# EAGLE design output_max10 (EAGLE 9.0.1)

## Sheet 1 of 2: IO and Memory
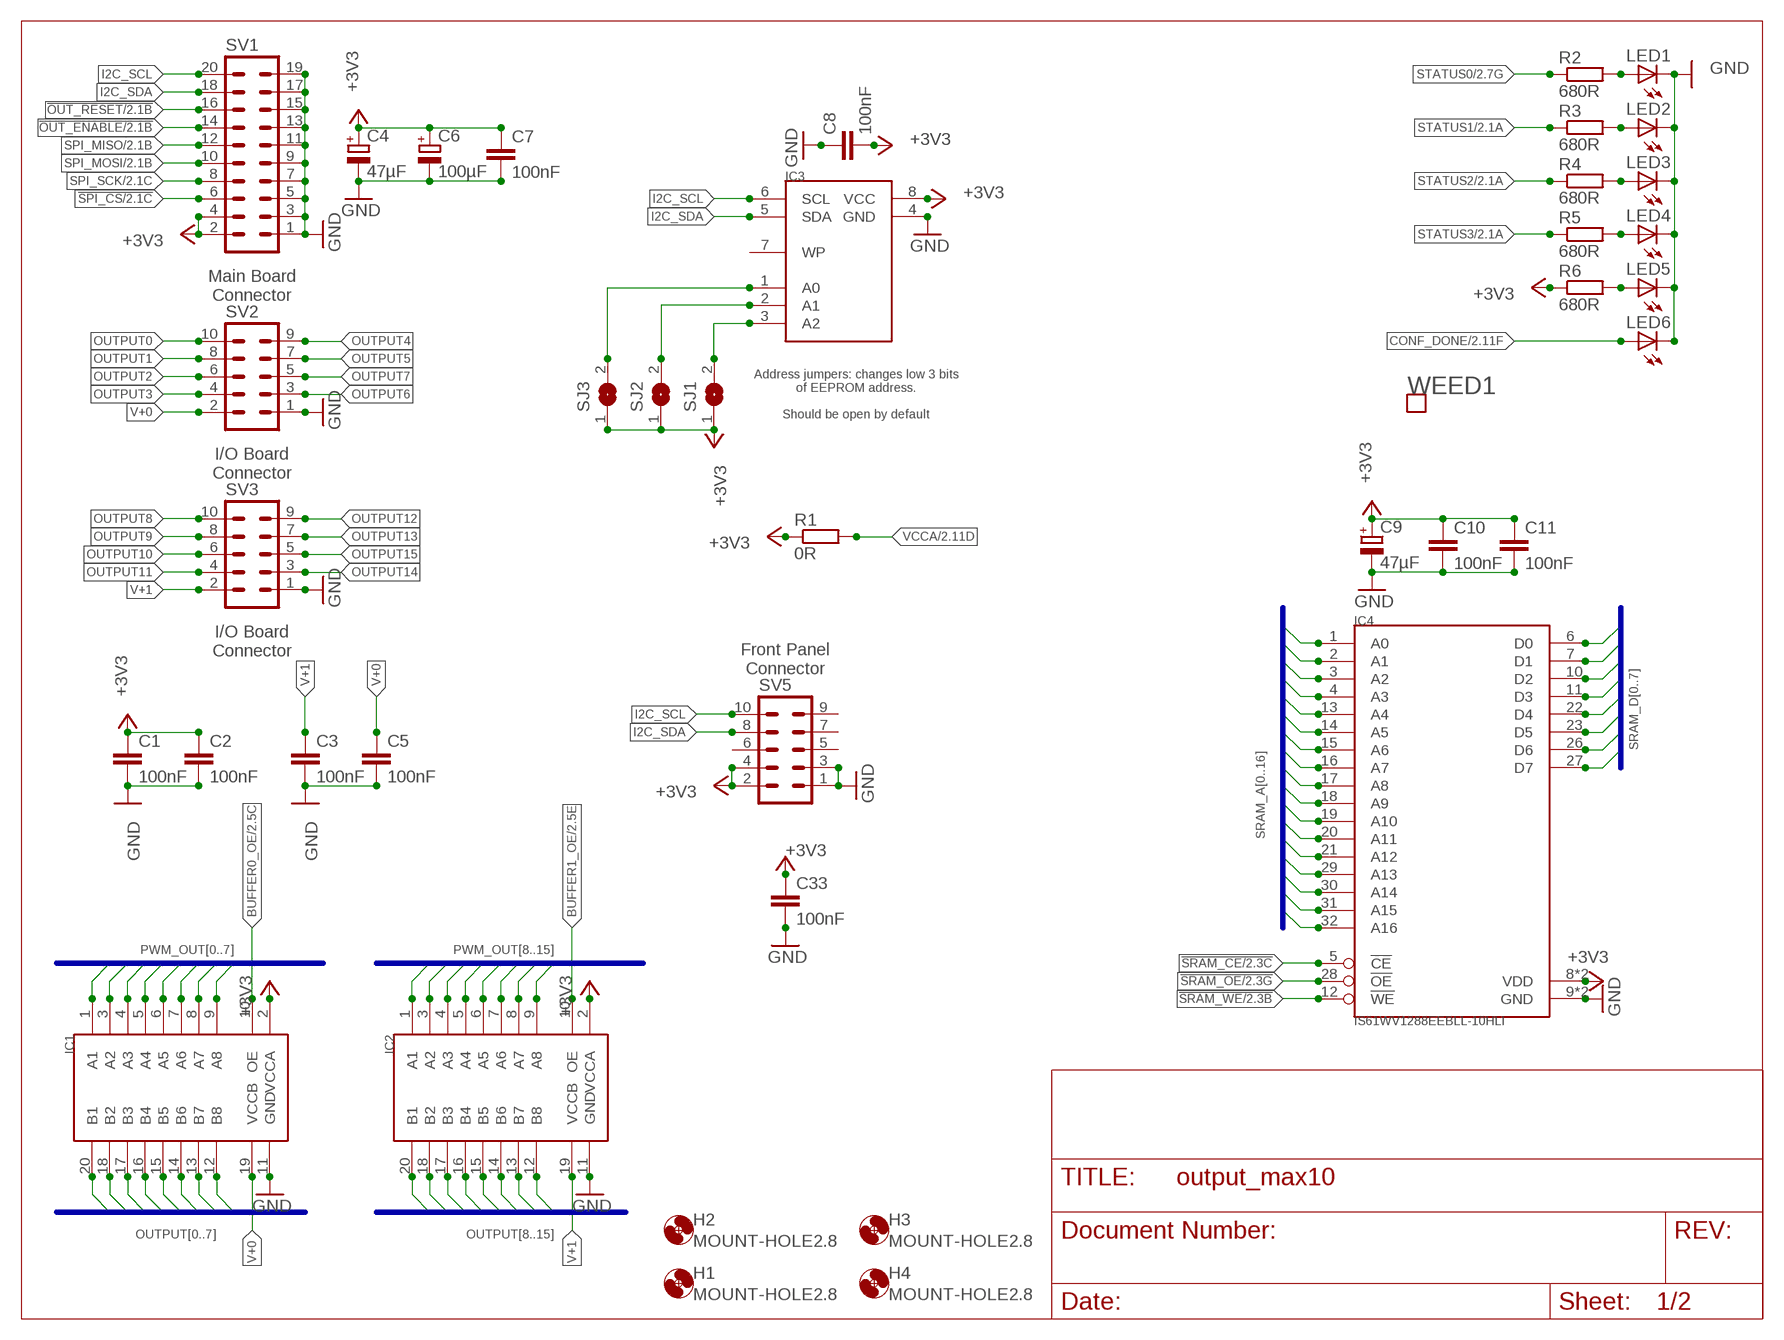
[diagram p0: schematic, sheet 1]

### Parts
C1  100nF  C-EUC0805  [C0805]
C2  100nF  C-EUC0805  [C0805]
C3  100nF  C-EUC0805  [C0805]
C4  47µF  CPOL-EUCT7343  [CT7343]
C5  100nF  C-EUC0805  [C0805]
C6  100µF  CPOL-EUCT7343  [CT7343]
C7  100nF  C-EUC0805  [C0805]
C8  100nF  C-EUC0805  [C0805]
C9  47µF  CPOL-EUCT7343  [CT7343]
C10  100nF  C-EUC0805  [C0805]
C11  100nF  C-EUC0805  [C0805]
C33  100nF  C-EUC0805  [C0805]
H1  MOUNT-HOLE2.8  [2,8]
H2  MOUNT-HOLE2.8  [2,8]
H3  MOUNT-HOLE2.8  [2,8]
H4  MOUNT-HOLE2.8  [2,8]
IC1  TXB0108TSSOP20  [TSSOP20]
IC2  TXB0108TSSOP20  [TSSOP20]
IC3  AT24C02DSOIC-8  [SOIC8]
IC4  IS61WV1288EEBLL-10HLI  IS61WV1288EEBLLTSOP32-I  [TSOP8X16]
LED1  LEDCHIPLED_1206  [CHIPLED_1206]
LED2  LEDCHIPLED_1206  [CHIPLED_1206]
LED3  LEDCHIPLED_1206  [CHIPLED_1206]
LED4  LEDCHIPLED_1206  [CHIPLED_1206]
LED5  LEDCHIPLED_1206  [CHIPLED_1206]
LED6  LEDCHIPLED_1206  [CHIPLED_1206]
R1  0R  R-EU_R2012  [R2012]
R2  680R  R-EU_M0805  [M0805]
R3  680R  R-EU_M0805  [M0805]
R4  680R  R-EU_M0805  [M0805]
R5  680R  R-EU_M0805  [M0805]
R6  680R  R-EU_M0805  [M0805]
SJ1  SJ  [SJ]
SJ2  SJ  [SJ]
SJ3  SJ  [SJ]
SV1  MA10-2  [MA10-2]
SV2  MA05-2  [MA05-2]
SV3  MA05-2  [MA05-2]
SV5  MA05-2  [MA05-2]
WEED1  WEED  [DOINK]

### Nets
!OUT_ENABLE: SV1.14 ; also sheet 2
!OUT_RESET: SV1.16 ; also sheet 2
!SPI_CS: SV1.6 ; also sheet 2
!SRAM_CE: IC4.5(!CE) ; also sheet 2
!SRAM_OE: IC4.28(!OE) ; also sheet 2
!SRAM_WE: IC4.12(!WE) ; also sheet 2
+3V3: C1.1 C2.1 C4.+ C6.+ C7.1 C8.2 C9.+ C10.1 C11.1 C33.1 IC1.2(VCCA) IC2.2(VCCA) IC3.8(VCC) IC4.8(VDD) IC4.24(VDD) R1.1 R6.1 SJ1.1 SJ2.1 SJ3.1 SV1.2 SV1.4 SV5.2 SV5.4 ; also sheet 2
BUFFER0_OE: IC1.10(OE) ; also sheet 2
BUFFER1_OE: IC2.10(OE) ; also sheet 2
CONF_DONE: LED6.A ; also sheet 2
GND: C1.2 C2.2 C3.2 C4.- C5.2 C6.- C7.2 C8.1 C9.- C10.2 C11.2 C33.2 IC1.11(GND) IC2.11(GND) IC3.4(GND) IC4.9(GND) IC4.25(GND) LED1.C LED2.C LED3.C LED4.C LED5.C LED6.C SV1.1 SV1.3 SV1.5 SV1.7 SV1.9 SV1.11 SV1.13 SV1.15 SV1.17 SV1.19 SV2.1 SV3.1 SV5.1 SV5.3 ; also sheet 2
I2C_SCL: IC3.6(SCL) SV1.20 SV5.10
I2C_SDA: IC3.5(SDA) SV1.18 SV5.8
N$1: LED3.A R4.2
N$2: LED4.A R5.2
N$3: LED5.A R6.2
N$5: IC3.3(A2) SJ1.2
N$6: IC3.2(A1) SJ2.2
N$7: IC3.1(A0) SJ3.2
N$13: LED1.A R2.2
N$14: LED2.A R3.2
OUTPUT0: IC1.20(B1) SV2.10
OUTPUT1: IC1.18(B2) SV2.8
OUTPUT2: IC1.17(B3) SV2.6
OUTPUT3: IC1.16(B4) SV2.4
OUTPUT4: IC1.15(B5) SV2.9
OUTPUT5: IC1.14(B6) SV2.7
OUTPUT6: IC1.13(B7) SV2.3
OUTPUT7: IC1.12(B8) SV2.5
OUTPUT8: IC2.20(B1) SV3.10
OUTPUT9: IC2.18(B2) SV3.8
OUTPUT10: IC2.17(B3) SV3.6
OUTPUT11: IC2.16(B4) SV3.4
OUTPUT12: IC2.15(B5) SV3.9
OUTPUT13: IC2.14(B6) SV3.7
OUTPUT14: IC2.13(B7) SV3.3
OUTPUT15: IC2.12(B8) SV3.5
PWM_OUT0: IC1.9(A8) ; also sheet 2
PWM_OUT1: IC1.8(A7) ; also sheet 2
PWM_OUT2: IC1.7(A6) ; also sheet 2
PWM_OUT3: IC1.6(A5) ; also sheet 2
PWM_OUT4: IC1.5(A4) ; also sheet 2
PWM_OUT5: IC1.4(A3) ; also sheet 2
PWM_OUT6: IC1.3(A2) ; also sheet 2
PWM_OUT7: IC1.1(A1) ; also sheet 2
PWM_OUT8: IC2.9(A8) ; also sheet 2
PWM_OUT9: IC2.8(A7) ; also sheet 2
PWM_OUT10: IC2.7(A6) ; also sheet 2
PWM_OUT11: IC2.6(A5) ; also sheet 2
PWM_OUT12: IC2.5(A4) ; also sheet 2
PWM_OUT13: IC2.4(A3) ; also sheet 2
PWM_OUT14: IC2.3(A2) ; also sheet 2
PWM_OUT15: IC2.1(A1) ; also sheet 2
SPI_MISO: SV1.12 ; also sheet 2
SPI_MOSI: SV1.10 ; also sheet 2
SPI_SCK: SV1.8 ; also sheet 2
SRAM_A0: IC4.1(A0) ; also sheet 2
SRAM_A1: IC4.2(A1) ; also sheet 2
SRAM_A2: IC4.3(A2) ; also sheet 2
SRAM_A3: IC4.4(A3) ; also sheet 2
SRAM_A4: IC4.13(A4) ; also sheet 2
SRAM_A5: IC4.14(A5) ; also sheet 2
SRAM_A6: IC4.15(A6) ; also sheet 2
SRAM_A7: IC4.16(A7) ; also sheet 2
SRAM_A8: IC4.17(A8) ; also sheet 2
SRAM_A9: IC4.18(A9) ; also sheet 2
SRAM_A10: IC4.19(A10) ; also sheet 2
SRAM_A11: IC4.20(A11) ; also sheet 2
SRAM_A12: IC4.21(A12) ; also sheet 2
SRAM_A13: IC4.29(A13) ; also sheet 2
SRAM_A14: IC4.30(A14) ; also sheet 2
SRAM_A15: IC4.31(A15) ; also sheet 2
SRAM_A16: IC4.32(A16) ; also sheet 2
SRAM_D0: IC4.6(D0) ; also sheet 2
SRAM_D1: IC4.7(D1) ; also sheet 2
SRAM_D2: IC4.10(D2) ; also sheet 2
SRAM_D3: IC4.11(D3) ; also sheet 2
SRAM_D4: IC4.22(D4) ; also sheet 2
SRAM_D5: IC4.23(D5) ; also sheet 2
SRAM_D6: IC4.26(D6) ; also sheet 2
SRAM_D7: IC4.27(D7) ; also sheet 2
STATUS0: R2.1 ; also sheet 2
STATUS1: R3.1 ; also sheet 2
STATUS2: R4.1 ; also sheet 2
STATUS3: R5.1 ; also sheet 2
V+0: C5.1 IC1.19(VCCB) SV2.2
V+1: C3.1 IC2.19(VCCB) SV3.2
VCCA: R1.2 ; also sheet 2
Unconnected: IC3.7(WP) SV5.5 SV5.6 SV5.7 SV5.9

### Buses
SRAM_D[0..7]
SRAM_A[0..16]
PWM_OUT[0..7]
OUTPUT[0..7]
OUTPUT[8..15]
PWM_OUT[8..15]

### Notes on the sheet
- Main Board
  Connector
- Address jumpers: changes low 3 bits
  of EEPROM address.
  
  Should be open by default
- I/O Board
  Connector
- I/O Board
  Connector
- Front Panel
  Connector

## Sheet 2 of 2: FPGA
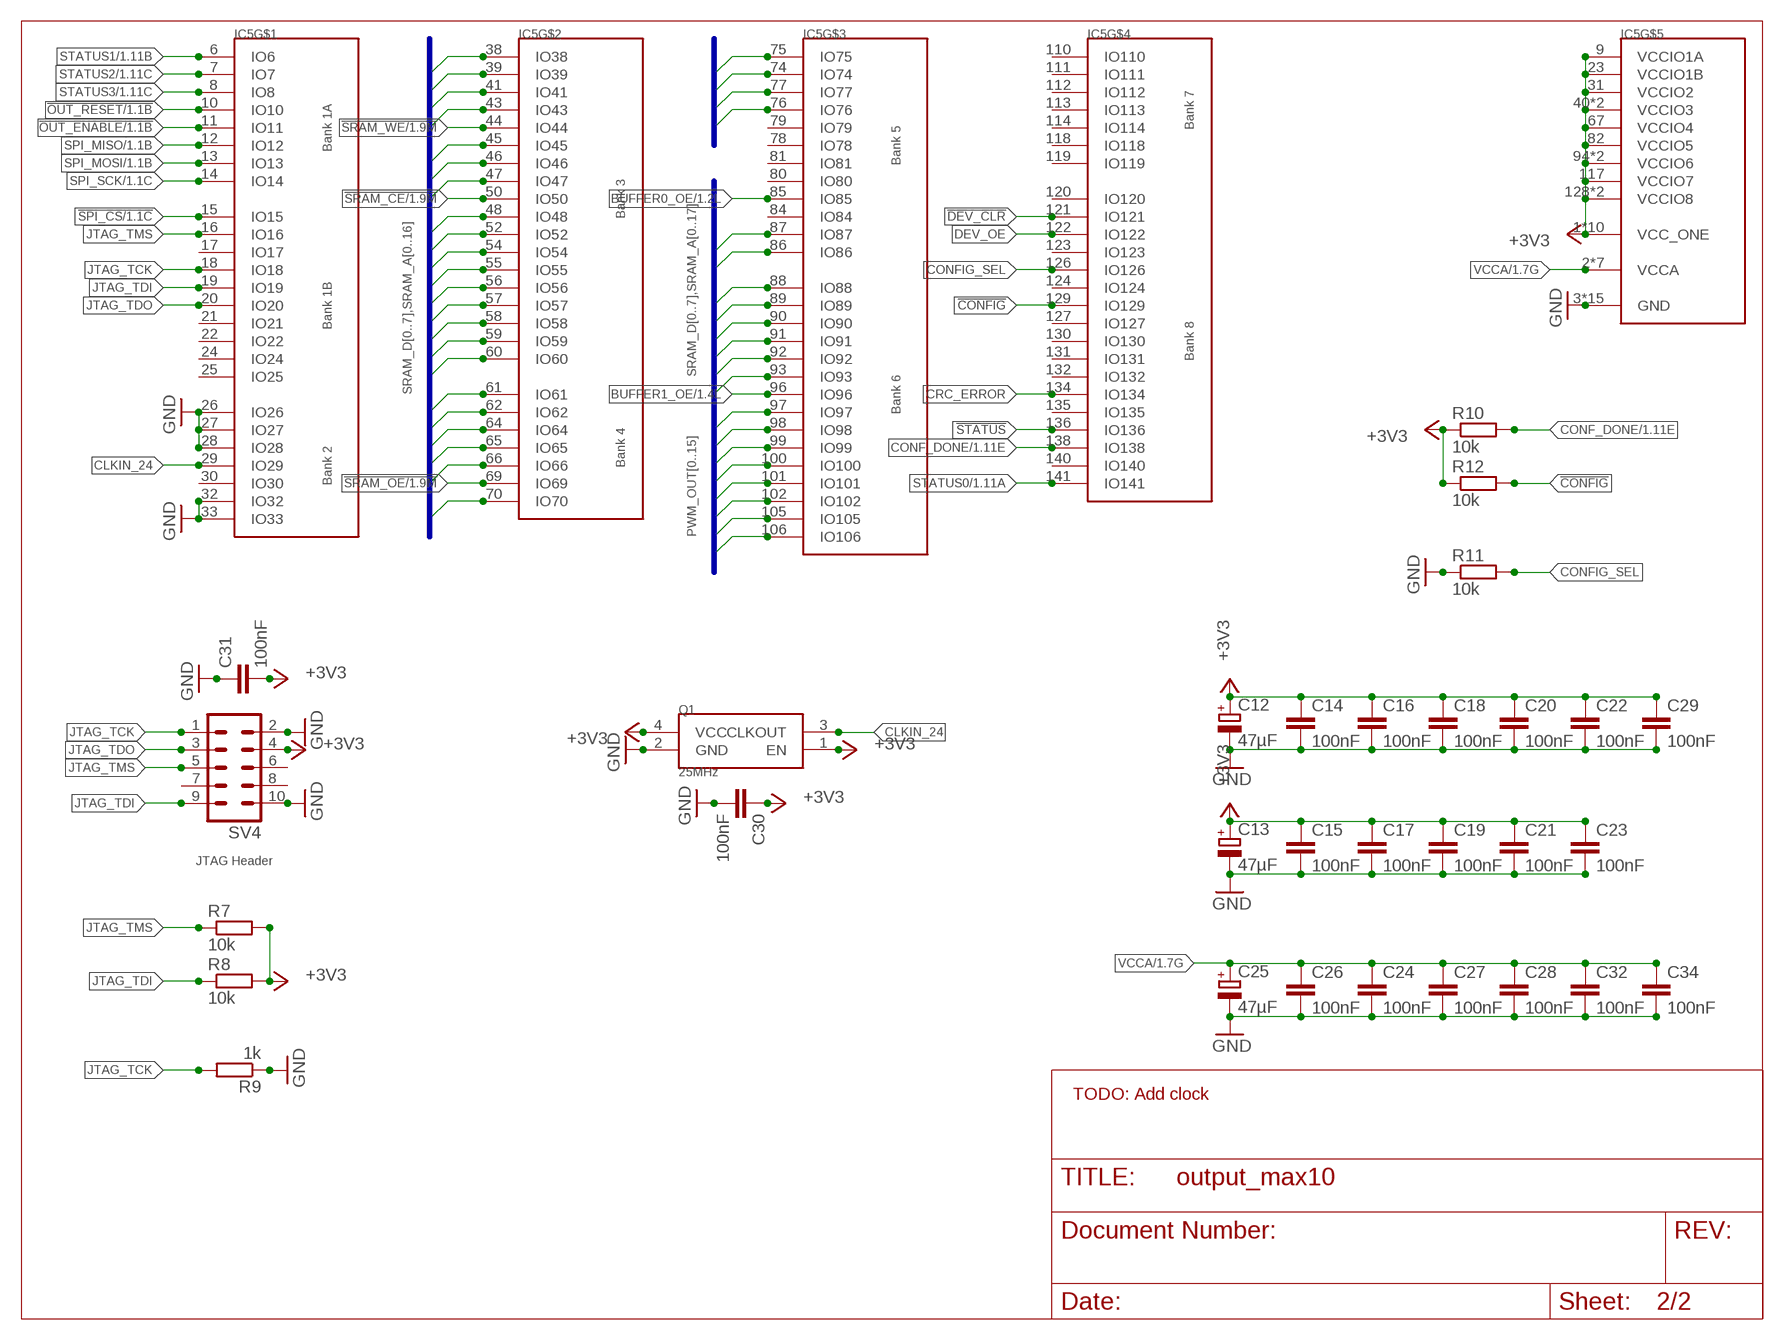
[diagram p1: schematic, sheet 2]

### Parts
C12  47µF  CPOL-EUCT7343  [CT7343]
C13  47µF  CPOL-EUCT7343  [CT7343]
C14  100nF  C-EUC0805  [C0805]
C15  100nF  C-EUC0805  [C0805]
C16  100nF  C-EUC0805  [C0805]
C17  100nF  C-EUC0805  [C0805]
C18  100nF  C-EUC0805  [C0805]
C19  100nF  C-EUC0805  [C0805]
C20  100nF  C-EUC0805  [C0805]
C21  100nF  C-EUC0805  [C0805]
C22  100nF  C-EUC0805  [C0805]
C23  100nF  C-EUC0805  [C0805]
C24  100nF  C-EUC0805  [C0805]
C25  47µF  CPOL-EUCT7343  [CT7343]
C26  100nF  C-EUC0805  [C0805]
C27  100nF  C-EUC0805  [C0805]
C28  100nF  C-EUC0805  [C0805]
C29  100nF  C-EUC0805  [C0805]
C30  100nF  C-EUC0805  [C0805]
C31  100nF  C-EUC0805  [C0805]
C32  100nF  C-EUC0805  [C0805]
C34  100nF  C-EUC0805  [C0805]
IC5  10M04EQFP144  [EQFP144]
Q1  25MHz  DSC61XX  [VLGA-4]
R7  10k  R-EU_M0805  [M0805]
R8  10k  R-EU_M0805  [M0805]
R9  1k  R-EU_M0805  [M0805]
R10  10k  R-EU_M0805  [M0805]
R11  10k  R-EU_M0805  [M0805]
R12  10k  R-EU_M0805  [M0805]
SV4  MA05-2  [MA05-2]

### Nets
!CONFIG: IC5.129(IO129) R12.2
!DEV_CLR: IC5.121(IO121)
!OUT_ENABLE: IC5.11(IO11) ; also sheet 1
!OUT_RESET: IC5.10(IO10) ; also sheet 1
!SPI_CS: IC5.15(IO15) ; also sheet 1
!SRAM_CE: IC5.50(IO50) ; also sheet 1
!SRAM_OE: IC5.69(IO69) ; also sheet 1
!SRAM_WE: IC5.44(IO44) ; also sheet 1
!STATUS: IC5.136(IO136)
+3V3: C12.+ C13.+ C14.1 C15.1 C16.1 C17.1 C18.1 C19.1 C20.1 C21.1 C22.1 C23.1 C29.1 C30.1 C31.2 IC5.1(VCC_ONE) IC5.9(VCCIO1A) IC5.23(VCCIO1B) IC5.31(VCCIO2) IC5.36(VCC_ONE) IC5.37(VCC_ONE) IC5.40(VCCIO3) IC5.49(VCCIO3) IC5.51(VCC_ONE) IC5.67(VCCIO4) IC5.72(VCC_ONE) IC5.73(VCC_ONE) IC5.82(VCCIO5) IC5.94(VCCIO6) IC5.103(VCCIO6) IC5.108(VCC_ONE) IC5.109(VCC_ONE) IC5.115(VCC_ONE) IC5.117(VCCIO7) IC5.128(VCCIO8) IC5.139(VCCIO8) IC5.144(VCC_ONE) Q1.1(EN) Q1.4(VCC) R7.2 R8.2 R10.1 R12.1 SV4.4 ; also sheet 1
BUFFER0_OE: IC5.85(IO85) ; also sheet 1
BUFFER1_OE: IC5.96(IO96) ; also sheet 1
CLKIN_24: IC5.29(IO29) Q1.3(CLKOUT)
CONF_DONE: IC5.138(IO138) R10.2 ; also sheet 1
CONFIG_SEL: IC5.126(IO126) R11.2
CRC_ERROR: IC5.134(IO134)
DEV_OE: IC5.122(IO122)
GND: C12.- C13.- C14.2 C15.2 C16.2 C17.2 C18.2 C19.2 C20.2 C21.2 C22.2 C23.2 C24.2 C25.- C26.2 C27.2 C28.2 C29.2 C30.2 C31.1 C32.2 C34.2 IC5.3(GND) IC5.4(GND) IC5.26(IO26) IC5.27(IO27) IC5.28(IO28) IC5.32(IO32) IC5.33(IO33) IC5.42(GND) IC5.53(GND) IC5.63(GND) IC5.68(GND) IC5.83(GND) IC5.95(GND) IC5.104(GND) IC5.116(GND) IC5.125(GND) IC5.133(GND) IC5.137(GND) IC5.142(GND) IC5.PAD(GND) Q1.2(GND) R9.1 R11.1 SV4.2 SV4.10 ; also sheet 1
JTAG_TCK: IC5.18(IO18) R9.2 SV4.1
JTAG_TDI: IC5.19(IO19) R8.1 SV4.9
JTAG_TDO: IC5.20(IO20) SV4.3
JTAG_TMS: IC5.16(IO16) R7.1 SV4.5
PWM_OUT0: IC5.86(IO86) ; also sheet 1
PWM_OUT1: IC5.87(IO87) ; also sheet 1
PWM_OUT2: IC5.88(IO88) ; also sheet 1
PWM_OUT3: IC5.89(IO89) ; also sheet 1
PWM_OUT4: IC5.90(IO90) ; also sheet 1
PWM_OUT5: IC5.91(IO91) ; also sheet 1
PWM_OUT6: IC5.92(IO92) ; also sheet 1
PWM_OUT7: IC5.93(IO93) ; also sheet 1
PWM_OUT8: IC5.97(IO97) ; also sheet 1
PWM_OUT9: IC5.98(IO98) ; also sheet 1
PWM_OUT10: IC5.99(IO99) ; also sheet 1
PWM_OUT11: IC5.100(IO100) ; also sheet 1
PWM_OUT12: IC5.101(IO101) ; also sheet 1
PWM_OUT13: IC5.102(IO102) ; also sheet 1
PWM_OUT14: IC5.105(IO105) ; also sheet 1
PWM_OUT15: IC5.106(IO106) ; also sheet 1
SPI_MISO: IC5.12(IO12) ; also sheet 1
SPI_MOSI: IC5.13(IO13) ; also sheet 1
SPI_SCK: IC5.14(IO14) ; also sheet 1
SRAM_A0: IC5.56(IO56) ; also sheet 1
SRAM_A1: IC5.55(IO55) ; also sheet 1
SRAM_A2: IC5.54(IO54) ; also sheet 1
SRAM_A3: IC5.52(IO52) ; also sheet 1
SRAM_A4: IC5.43(IO43) ; also sheet 1
SRAM_A5: IC5.41(IO41) ; also sheet 1
SRAM_A6: IC5.39(IO39) ; also sheet 1
SRAM_A7: IC5.38(IO38) ; also sheet 1
SRAM_A8: IC5.57(IO57) ; also sheet 1
SRAM_A9: IC5.58(IO58) ; also sheet 1
SRAM_A10: IC5.59(IO59) ; also sheet 1
SRAM_A11: IC5.60(IO60) ; also sheet 1
SRAM_A12: IC5.61(IO61) ; also sheet 1
SRAM_A13: IC5.70(IO70) ; also sheet 1
SRAM_A14: IC5.76(IO76) ; also sheet 1
SRAM_A15: IC5.75(IO75) ; also sheet 1
SRAM_A16: IC5.74(IO74) ; also sheet 1
SRAM_A17: IC5.77(IO77)
SRAM_D0: IC5.48(IO48) ; also sheet 1
SRAM_D1: IC5.47(IO47) ; also sheet 1
SRAM_D2: IC5.46(IO46) ; also sheet 1
SRAM_D3: IC5.45(IO45) ; also sheet 1
SRAM_D4: IC5.62(IO62) ; also sheet 1
SRAM_D5: IC5.64(IO64) ; also sheet 1
SRAM_D6: IC5.65(IO65) ; also sheet 1
SRAM_D7: IC5.66(IO66) ; also sheet 1
STATUS0: IC5.141(IO141) ; also sheet 1
STATUS1: IC5.6(IO6) ; also sheet 1
STATUS2: IC5.7(IO7) ; also sheet 1
STATUS3: IC5.8(IO8) ; also sheet 1
VCCA: C24.1 C25.+ C26.1 C27.1 C28.1 C32.1 C34.1 IC5.2(VCCA) IC5.5(VCCA) IC5.34(VCCA) IC5.35(VCCA) IC5.71(VCCA) IC5.107(VCCA) IC5.143(VCCA) ; also sheet 1
Unconnected: IC5.17(IO17) IC5.21(IO21) IC5.22(IO22) IC5.24(IO24) IC5.25(IO25) IC5.30(IO30) IC5.78(IO78) IC5.79(IO79) IC5.80(IO80) IC5.81(IO81) IC5.84(IO84) IC5.110(IO110) IC5.111(IO111) IC5.112(IO112) IC5.113(IO113) IC5.114(IO114) IC5.118(IO118) IC5.119(IO119) IC5.120(IO120) IC5.123(IO123) IC5.124(IO124) IC5.127(IO127) IC5.130(IO130) IC5.131(IO131) IC5.132(IO132) IC5.135(IO135) IC5.140(IO140) SV4.6 SV4.7 SV4.8

### Buses
SRAM_D[0..7],SRAM_A[0..16]
SRAM_D[0..7],SRAM_A[0..17]
PWM_OUT[0..15]

### Notes on the sheet
- JTAG Header
- TODO: Add clock

## Library data of the parts
C1-C3 C5 C7 C8 C10 C11 C14-C24 C26-C34 = rcl:C-EU: CAPACITOR, European symbol; MOUSER: 710-885012207072; SPICEPREFIX: C
C4 C9 C12 C13 C25 = rcl:CPOL-EU: POLARIZED CAPACITOR, European symbol; MOUSER: 581-TAJD476M016RNJV; SPICEPREFIX: C
C6 = rcl:CPOL-EU: POLARIZED CAPACITOR, European symbol; MOUSER: 581-NOSD107M006; SPICEPREFIX: C
H1-H4 = holes:MOUNT-HOLE: MOUNTING HOLE with drill center marker
IC1 IC2 = lichtenstein_onion:TXB0108: 8-Bit Bidirectional Voltage-Level Translator with Auto-Direction Sensing and ±15-kV ESD Protection Datasheet <http://www.ti.com/lit/ds/symlink/txb0108.pdf>; MOUSER: 595-TXB0108PWR
IC3 = lichtenstein_onion:AT24C02D: I2C-Compatible (2-wire) Serial EEPROM; 1-Kbit (128 x 8) or 2-Kbit (256 x 8) Datasheet <http://ww1.microchip.com/downloads/en/DeviceDoc/Atmel-8871F-SEEPROM-AT24C01D-02D-Datasheet.pdf>; MOUSER: 556-AT24C02D-SSHM-T
IC4 = lichtenstein_onion:IS61WV1288EEBLL: 128K x 8 HIGH SPEED ASYNCHRONOUS CMOS STATIC RAM WITH ECC Datasheet <https://www.mouser.com/datasheet/2/198/61-64WV1288EEBLL-337356.pdf>; MOUSER: 870-61WV1288ELL10HLI
IC5 = lichtenstein_onion:10M04: 10M04SCE144 edit this description Auto generated by make-symbol-device-package-bsdl.ulp Rev. 44 Source: 10M04SCE144.bsd; MOUSER: 989-10M04SCE144C8G
LED1 = led:LED: LED OSRAM: - CHIPLED LG R971, LG N971, LY N971, LG Q971, LY Q971, LO R971, LY R971 LH N974, LH R974 LS Q976, LO Q976, LY Q976 LO Q996 - Hyper CHIPLED LW Q18S LB Q993, LB Q99A, LB R99A - SideLED LS A670, LO A670, LY A670, LG A670, LP A670 LB A673, LV A673, LT A673, LW A673 LH A674 LY A675 LS A676, LA A676, LO A676, LY A676, LW A676 LS A679, LY A679, LG A679 - Hyper Micro SIDELED® LS Y876, LA Y876, LO Y876, LY Y876 LT Y87S - SmartLED LW L88C, LW L88S LB L89C, LB L89S, LG L890 LS L89K, LO L89K, LY L89K LS L896, LA L896, LO L896, LY L896 - TOPLED LS T670, LO T670, LY T670, LG T670, LP T670 LSG T670, LSP T670, LSY T670, LOP T670, LYG T670 LG T671, LOG T671, LSG T671 LB T673, LV T673, LT T673, LW T673 LH T674 LS T676, LA T676, LO T676, LY T676, LB T676, LH T676, LSB T676, LW T676 LB T67C, LV T67C, LT T67C, LS T67K, LO T67K, LY T67K, LW E67C LS E67B, LA E67B, LO E67B, LY E67B, LB E67C, LV E67C, LT E67C LW T67C LS T679, LY T679, LG T679 LS T770, LO T770, LY T770, LG T770, LP T770 LB T773, LV T773, LT T773, LW T773 LH T774 LS E675, LA E675, LY E675, LS T675 LS T776, LA T776, LO T776, LY T776, LB T776 LHGB T686 LT T68C, LB T68C - Hyper Mini TOPLED® LB M676 - Mini TOPLED Santana® LG M470 LS M47K, LO M47K, LY M47K Source: http://www.osram.convergy.de LUXEON: - LUMILED® LXK2-PW12-R00, LXK2-PW12-S00, LXK2-PW14-U00, LXK2-PW14-V00 LXK2-PM12-R00, LXK2-PM12-S00, LXK2-PM14-U00 LXK2-PE12-Q00, LXK2-PE12-R00, LXK2-PE12-S00, LXK2-PE14-T00, LXK2-PE14-U00 LXK2-PB12-K00, LXK2-PB12-L00, LXK2-PB12-M00, LXK2-PB14-N00, LXK2-PB14-P00, LXK2-PB14-Q00 LXK2-PR12-L00, LXK2-PR12-M00, LXK2-PR14-Q00, LXK2-PR14-R00 LXK2-PD12-Q00, LXK2-PD12-R00, LXK2-PD12-S00 LXK2-PH12-R00, LXK2-PH12-S00 LXK2-PL12-P00, LXK2-PL12-Q00, LXK2-PL12-R00 Source: www.luxeon.com KINGBRIGHT: KA-3528ASYC Source: www.kingbright.com; MOUSER: 604-APTR3216SRCPRV
LED2-LED6 = led:LED: LED OSRAM: - CHIPLED LG R971, LG N971, LY N971, LG Q971, LY Q971, LO R971, LY R971 LH N974, LH R974 LS Q976, LO Q976, LY Q976 LO Q996 - Hyper CHIPLED LW Q18S LB Q993, LB Q99A, LB R99A - SideLED LS A670, LO A670, LY A670, LG A670, LP A670 LB A673, LV A673, LT A673, LW A673 LH A674 LY A675 LS A676, LA A676, LO A676, LY A676, LW A676 LS A679, LY A679, LG A679 - Hyper Micro SIDELED® LS Y876, LA Y876, LO Y876, LY Y876 LT Y87S - SmartLED LW L88C, LW L88S LB L89C, LB L89S, LG L890 LS L89K, LO L89K, LY L89K LS L896, LA L896, LO L896, LY L896 - TOPLED LS T670, LO T670, LY T670, LG T670, LP T670 LSG T670, LSP T670, LSY T670, LOP T670, LYG T670 LG T671, LOG T671, LSG T671 LB T673, LV T673, LT T673, LW T673 LH T674 LS T676, LA T676, LO T676, LY T676, LB T676, LH T676, LSB T676, LW T676 LB T67C, LV T67C, LT T67C, LS T67K, LO T67K, LY T67K, LW E67C LS E67B, LA E67B, LO E67B, LY E67B, LB E67C, LV E67C, LT E67C LW T67C LS T679, LY T679, LG T679 LS T770, LO T770, LY T770, LG T770, LP T770 LB T773, LV T773, LT T773, LW T773 LH T774 LS E675, LA E675, LY E675, LS T675 LS T776, LA T776, LO T776, LY T776, LB T776 LHGB T686 LT T68C, LB T68C - Hyper Mini TOPLED® LB M676 - Mini TOPLED Santana® LG M470 LS M47K, LO M47K, LY M47K Source: http://www.osram.convergy.de LUXEON: - LUMILED® LXK2-PW12-R00, LXK2-PW12-S00, LXK2-PW14-U00, LXK2-PW14-V00 LXK2-PM12-R00, LXK2-PM12-S00, LXK2-PM14-U00 LXK2-PE12-Q00, LXK2-PE12-R00, LXK2-PE12-S00, LXK2-PE14-T00, LXK2-PE14-U00 LXK2-PB12-K00, LXK2-PB12-L00, LXK2-PB12-M00, LXK2-PB14-N00, LXK2-PB14-P00, LXK2-PB14-Q00 LXK2-PR12-L00, LXK2-PR12-M00, LXK2-PR14-Q00, LXK2-PR14-R00 LXK2-PD12-Q00, LXK2-PD12-R00, LXK2-PD12-S00 LXK2-PH12-R00, LXK2-PH12-S00 LXK2-PL12-P00, LXK2-PL12-Q00, LXK2-PL12-R00 Source: www.luxeon.com KINGBRIGHT: KA-3528ASYC Source: www.kingbright.com; MOUSER: 604-APTR3216SGC
Q1 = lichtenstein_onion:DSC61XX: Ultra-Small, Ultra-Low Power MEMS Oscillator Datasheet <https://www.mouser.com/datasheet/2/268/20005624B-1149202.pdf>; MOUSER: 579-6101JI2A0240000T
R1 = rcl:R-EU_: RESISTOR, European symbol; MOUSER: 623-2508056017Y2; SPICEPREFIX: R
R2-R6 = rcl:R-EU_: RESISTOR, European symbol; MOUSER: 652-CR0805-FX6800GLF; SPICEPREFIX: R
R7 R8 R10-R12 = rcl:R-EU_: RESISTOR, European symbol; MOUSER: 652-CR0805FX-1002ELF; SPICEPREFIX: R
R9 = rcl:R-EU_: RESISTOR, European symbol; MOUSER: 652-CR0805JW-102ELF; SPICEPREFIX: R
SJ1-SJ3 = jumper:SJ: SMD solder JUMPER
SV1 = con-lstb:MA10-2: PIN HEADER; MOUSER: 517-30320-6002; OC_FARNELL: unknown; OC_NEWARK: unknown
SV2-SV5 = con-lstb:MA05-2: PIN HEADER; MOUSER: 517-30310-6002; OC_FARNELL: unknown; OC_NEWARK: unknown
WEED1 = lichtenstein_onion:WEED

## Board
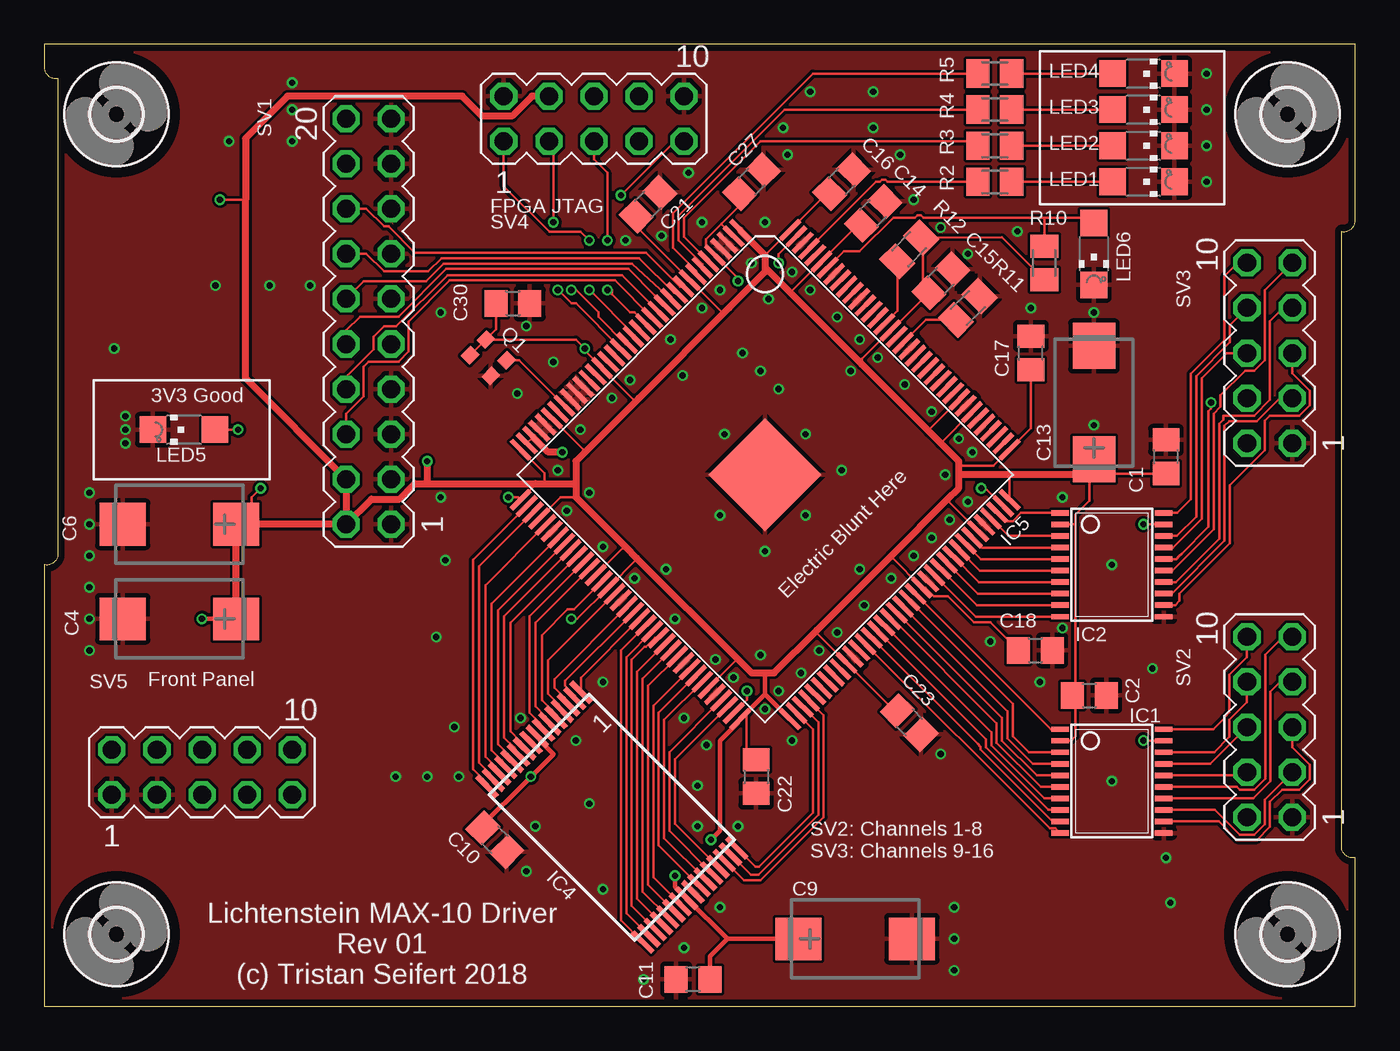
[diagram p2: board, top side]
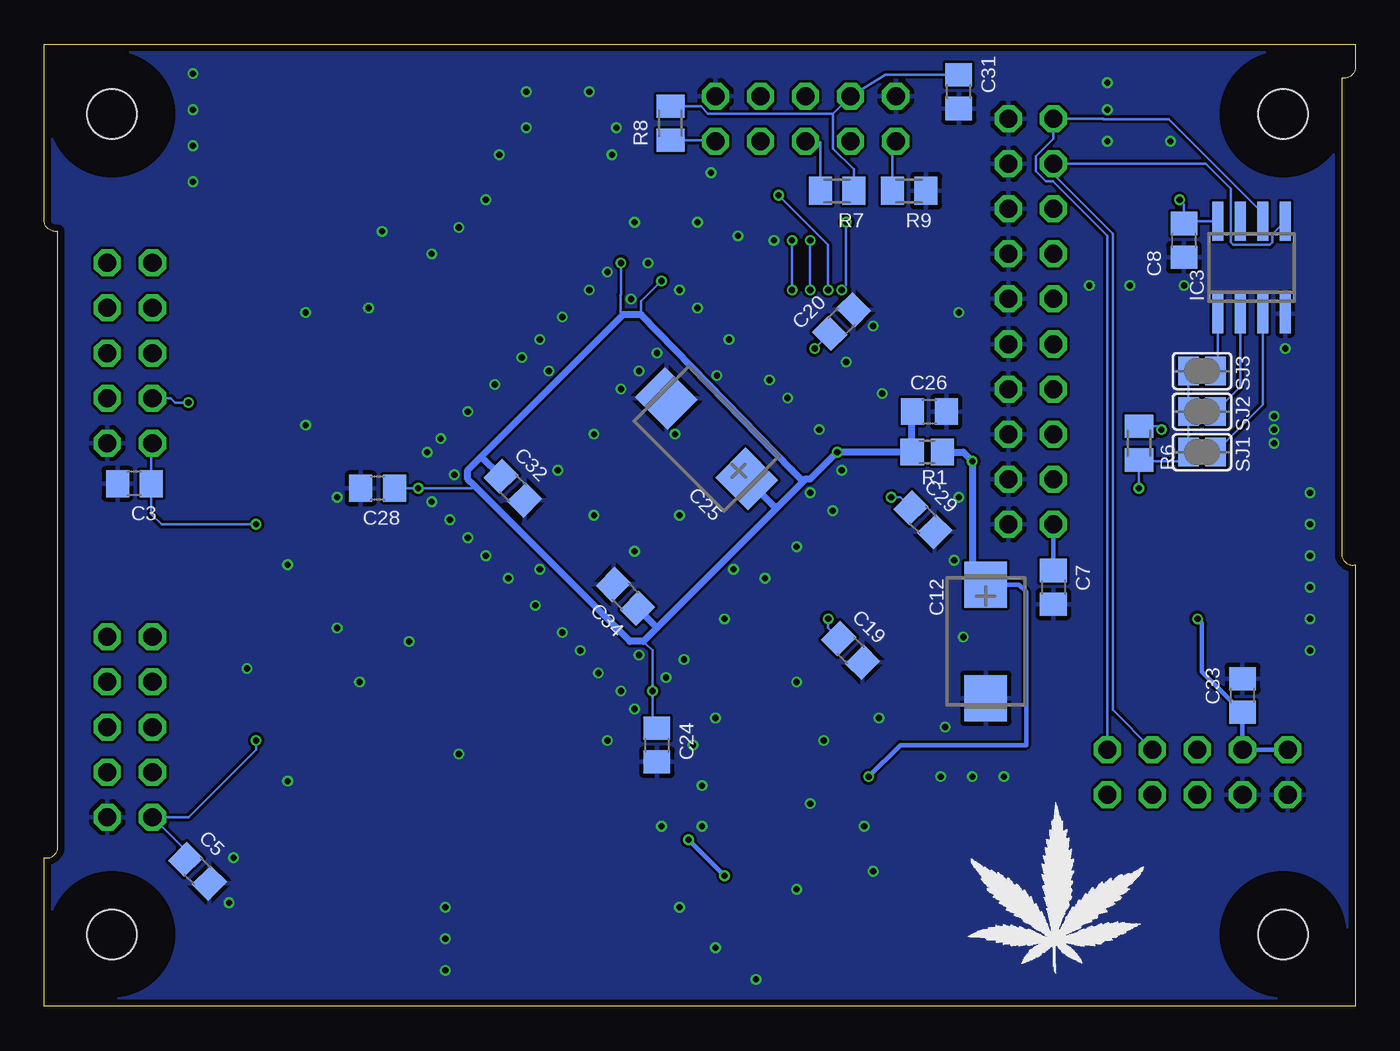
[diagram p3: board, bottom side, seen from below]

Size 73.91 x 54.23 mm. Coordinates in mm from the lower left corner, seen from the top.
Outline: 0,0 73.91,0 73.91,8.38 arc-90 73.15,8.89 73.15,43.69 arc90 73.91,44.2 73.91,54.23 0,54.23 0,52.83 arc90 0.76,52.32 0.76,25.4 arc-90 0,24.89 0,0
Copper layers (1*16): Top 0.035559375mm / dielectric 1.6mm / Bottom 0.035559375mm
Design rules "oshpark-2layer": minimum track width 6mil, minimum drill 10mil, track to track 6mil, track to pad 6mil, pad to pad 6mil, via to via 6mil, smd to smd 6mil, copper to edge 15mil, drill to drill 6mil, minimum pad ring 5mil, minimum via ring 5mil, stop-mask expansion 2.5mil, vias tented up to drill 0mil, thermal gap 10mil

### Footprints (pad centres in the part's own frame; a part is rotated, then mirrored left to right if it is on the bottom)
C0805 = smd 1.3 x 1.5: 1 -0.95,0; 2 0.95,0
CT7343 = smd 2.6 x 2.4: + -3.2,0; - 3.2,0
2,8 = hole 2.8: 0,0
TSSOP20 = smd 0.305 x 0.991: 1 -2.925,-2.918; 2 -2.275,-2.918; 3 -1.625,-2.918; 4 -0.975,-2.918; 5 -0.325,-2.918; 6 0.325,-2.918; 7 0.975,-2.918; 8 1.625,-2.918; 9 2.275,-2.918; 10 2.925,-2.918; 11 2.925,2.918; 12 2.275,2.918; 13 1.625,2.918; 14 0.975,2.918; 15 0.325,2.918; 16 -0.325,2.918; 17 -0.975,2.918; 18 -1.625,2.918; 19 -2.275,2.918; 20 -2.925,2.918
SOIC8 = smd 0.6 x 2.2: 1 -1.905,-2.6; 2 -0.635,-2.6; 3 0.635,-2.6; 4 1.905,-2.6; 5 1.905,2.6; 6 0.635,2.6; 7 -0.635,2.6; 8 -1.905,2.6
TSOP8X16 = smd 0.3 x 1.6: 1 -3.75,-6.204; 2 -3.25,-6.204; 3 -2.75,-6.204; 4 -2.25,-6.204; 5 -1.75,-6.204; 6 -1.25,-6.204; 7 -0.75,-6.204; 8 -0.25,-6.204; 9 0.25,-6.204; 10 0.75,-6.204; 11 1.25,-6.204; 12 1.75,-6.204; 13 2.25,-6.204; 14 2.75,-6.204; 15 3.25,-6.204; 16 3.75,-6.204; 17 3.75,6.204; 18 3.25,6.204; 19 2.75,6.204; 20 2.25,6.204; 21 1.75,6.204; 22 1.25,6.204; 23 0.75,6.204; 24 0.25,6.204; 25 -0.25,6.204; 26 -0.75,6.204; 27 -1.25,6.204; 28 -1.75,6.204; 29 -2.25,6.204; 30 -2.75,6.204; 31 -3.25,6.204; 32 -3.75,6.204
EQFP144 = smd 0.27 x 1.5: 1 -8.75,-10.75; 2 -8.25,-10.75; 3 -7.75,-10.75; 4 -7.25,-10.75; 5 -6.75,-10.75; 6 -6.25,-10.75; 7 -5.75,-10.75; 8 -5.25,-10.75; 9 -4.75,-10.75; 10 -4.25,-10.75; 11 -3.75,-10.75; 12 -3.25,-10.75; 13 -2.75,-10.75; 14 -2.25,-10.75; 15 -1.75,-10.75; 16 -1.25,-10.75; 17 -0.75,-10.75; 18 -0.25,-10.75; 19 0.25,-10.75; 20 0.75,-10.75; 21 1.25,-10.75; 22 1.75,-10.75; 23 2.25,-10.75; 24 2.75,-10.75; 25 3.25,-10.75; 26 3.75,-10.75; 27 4.25,-10.75; 28 4.75,-10.75; 29 5.25,-10.75; 30 5.75,-10.75; 31 6.25,-10.75; 32 6.75,-10.75; 33 7.25,-10.75; 34 7.75,-10.75; 35 8.25,-10.75; 36 8.75,-10.75; 73 8.75,10.75; 74 8.25,10.75; 75 7.75,10.75; 76 7.25,10.75; 77 6.75,10.75; 78 6.25,10.75; 79 5.75,10.75; 80 5.25,10.75; 81 4.75,10.75; 82 4.25,10.75; 83 3.75,10.75; 84 3.25,10.75; 85 2.75,10.75; 86 2.25,10.75; 87 1.75,10.75; 88 1.25,10.75; 89 0.75,10.75; 90 0.25,10.75; 91 -0.25,10.75; 92 -0.75,10.75; 93 -1.25,10.75; 94 -1.75,10.75; 95 -2.25,10.75; 96 -2.75,10.75; 97 -3.25,10.75; 98 -3.75,10.75; 99 -4.25,10.75; 100 -4.75,10.75; 101 -5.25,10.75; 102 -5.75,10.75; 103 -6.25,10.75; 104 -6.75,10.75; 105 -7.25,10.75; 106 -7.75,10.75; 107 -8.25,10.75; 108 -8.75,10.75 | smd 1.5 x 0.27: 37 10.75,-8.75; 38 10.75,-8.25; 39 10.75,-7.75; 40 10.75,-7.25; 41 10.75,-6.75; 42 10.75,-6.25; 43 10.75,-5.75; 44 10.75,-5.25; 45 10.75,-4.75; 46 10.75,-4.25; 47 10.75,-3.75; 48 10.75,-3.25; 49 10.75,-2.75; 50 10.75,-2.25; 51 10.75,-1.75; 52 10.75,-1.25; 53 10.75,-0.75; 54 10.75,-0.25; 55 10.75,0.25; 56 10.75,0.75; 57 10.75,1.25; 58 10.75,1.75; 59 10.75,2.25; 60 10.75,2.75; 61 10.75,3.25; 62 10.75,3.75; 63 10.75,4.25; 64 10.75,4.75; 65 10.75,5.25; 66 10.75,5.75; 67 10.75,6.25; 68 10.75,6.75; 69 10.75,7.25; 70 10.75,7.75; 71 10.75,8.25; 72 10.75,8.75; 109 -10.75,8.75; 110 -10.75,8.25; 111 -10.75,7.75; 112 -10.75,7.25; 113 -10.75,6.75; 114 -10.75,6.25; 115 -10.75,5.75; 116 -10.75,5.25; 117 -10.75,4.75; 118 -10.75,4.25; 119 -10.75,3.75; 120 -10.75,3.25; 121 -10.75,2.75; 122 -10.75,2.25; 123 -10.75,1.75; 124 -10.75,1.25; 125 -10.75,0.75; 126 -10.75,0.25; 127 -10.75,-0.25; 128 -10.75,-0.75; 129 -10.75,-1.25; 130 -10.75,-1.75; 131 -10.75,-2.25; 132 -10.75,-2.75; 133 -10.75,-3.25; 134 -10.75,-3.75; 135 -10.75,-4.25; 136 -10.75,-4.75; 137 -10.75,-5.25; 138 -10.75,-5.75; 139 -10.75,-6.25; 140 -10.75,-6.75; 141 -10.75,-7.25; 142 -10.75,-7.75; 143 -10.75,-8.25; 144 -10.75,-8.75 | smd 4.5 x 4.5: PAD 0,0
CHIPLED_1206 = smd 1.5 x 1.5: A 0,-1.75; C 0,1.75
VLGA-4 = smd 0.7 x 0.8: 1 0,-1.25; 2 1.65,-1.25; 3 1.65,0; 4 0,0
R2012 = smd 1.3 x 1.5: 1 -0.85,0; 2 0.85,0
M0805 = smd 1.3 x 1.6: 1 -0.95,0; 2 0.95,0
SJ = smd 1.168 x 1.6: 1 -0.762,0; 2 0.762,0
MA10-2 = drill 1.016 octagon: 1 -11.43,-1.27; 2 -11.43,1.27; 3 -8.89,-1.27; 4 -8.89,1.27; 5 -6.35,-1.27; 6 -6.35,1.27; 7 -3.81,-1.27; 8 -3.81,1.27; 9 -1.27,-1.27; 10 -1.27,1.27; 11 1.27,-1.27; 12 1.27,1.27; 13 3.81,-1.27; 14 3.81,1.27; 15 6.35,-1.27; 16 6.35,1.27; 17 8.89,-1.27; 18 8.89,1.27; 19 11.43,-1.27; 20 11.43,1.27
MA05-2 = drill 1.016 octagon: 1 -5.08,-1.27; 2 -5.08,1.27; 3 -2.54,-1.27; 4 -2.54,1.27; 5 0,-1.27; 6 0,1.27; 7 2.54,-1.27; 8 2.54,1.27; 9 5.08,-1.27; 10 5.08,1.27

### Placement (x,y rotation side)
C1  63.25,30.99 90 top
C2  58.93,17.53 0 top
C3  68.83,29.46 180 bottom
C4  7.62,21.84 180 top
C5  65.28,7.62 315 bottom
C6  7.62,27.18 180 top
C7  17.02,23.62 270 bottom
C8  9.65,43.18 90 bottom
C9  45.72,3.81 0 top
C10  25.4,9.4 315 top
C11  36.58,1.52 180 top
C12  20.83,20.57 270 bottom
C13  59.18,34.04 90 top
C14  46.74,44.7 45 top
C15  50.55,40.89 45 top
C16  44.96,46.48 45 top
C17  55.63,36.83 90 top
C18  55.88,20.07 0 top
C19  28.45,20.07 315 bottom
C20  28.96,38.61 45 bottom
C21  34.04,45.21 45 top
C22  40.13,12.95 270 top
C23  48.77,16 315 top
C24  39.37,14.73 270 bottom
C25  36.58,32 135 bottom
C26  24,33.53 0 bottom
C27  39.88,46.48 45 top
C28  55.12,29.21 180 bottom
C29  24.38,27.43 315 bottom
C30  26.42,39.62 0 top
C31  22.35,51.56 90 bottom
C32  47.5,29.21 315 bottom
C33  6.35,17.53 90 bottom
C34  41.15,23.11 135 bottom
H1  4.06,4.06 0 top
H2  4.06,50.29 0 top
H3  70.1,4.06 0 top
H4  70.1,50.29 0 top
IC1  60.2,12.7 270 top
IC2  60.2,24.89 270 top
IC3  5.84,41.66 0 bottom
IC4  32,10.67 225 top
IC5  40.64,29.97 225 top
LED1  61.98,46.48 270 top
LED2  61.98,48.51 270 top
LED3  61.98,50.55 270 top
LED4  61.98,52.58 270 top
LED5  7.87,32.51 90 top
LED6  59.18,42.42 180 top
Q1  24.89,37.59 315 top
R1  24.13,31.24 180 bottom
R2  53.59,46.48 0 top
R3  53.59,48.51 0 top
R4  53.59,50.55 0 top
R5  53.59,52.58 0 top
R6  12.19,31.75 90 bottom
R7  29.21,45.97 0 bottom
R8  38.61,49.78 90 bottom
R9  25.15,45.97 180 bottom
R10  56.39,41.91 90 top
R11  52.07,39.37 225 top
R12  48.77,42.67 225 top
SJ1  8.64,31.24 0 bottom
SJ2  8.64,33.53 0 bottom
SJ3  8.64,35.81 0 bottom
SV1  18.29,38.61 90 top
SV2  69.09,15.75 90 top
SV3  69.09,36.83 90 top
SV4  30.99,50.04 0 top
SV5  8.89,13.21 0 top
WEED1  21.84,1.78 0 bottom

### Tracks (layer width: path | path; a pad name or v marks a point on that pad's centre or on a via)
!CONFIG
  Top 0.152: R12.2 48.1,39.21 IC5.129
!OUT_ENABLE
  Top 0.152: SV1.14 18.16,42.42 19.15,41.43 21.65,41.43 22.4,42.18 33.14,42.18 33.26,42.18 33.55,42.18 35.5,40.23 IC5.11
!OUT_RESET
  Top 0.152: SV1.16 18.16,44.96 19.15,43.97 19.41,43.97 20.88,42.49 33.94,42.49 35.85,40.58 IC5.10
!SPI_CS
  Top 0.152: SV1.6 17.02,33.4 18.01,34.39 18.01,36.07 18.29,36.35 19.97,36.35 20.55,36.93 20.55,38.61 22.86,40.92 32.17,40.92 IC5.15
!SRAM_CE
  Top 0.152: IC4.5 28.6,16.72 28.05,17.27 28.05,20.93 29.5,22.38 29.86,22.38 IC5.50
!SRAM_OE
  Top 0.152: IC4.28 35.26,9.89 35.26,14.33 IC5.69
!SRAM_WE
  Top 0.152: IC4.12 26.13,14.24 25.58,14.79 25.58,22.34 IC5.44
+3V3  (via drill 0.35)
  Top 0.152: IC5.40 29.12,28.7 29.97,28.7 | 27.69,29.46 27.69,29.39 IC5.37 26.71,28.7 v26.16,28.7 | 28.19,29.46 28.19,30.04 IC5.36 | 40.64,42.35 IC5.144 43.85,45.56 C16.1 | 40.64,42.35 | 42.16,40.13 42.16,40.34 IC5.139 45.61,43.78 C14.1 | IC5.115 50.55,31.75 | IC5.117 49.91,32.52 49.91,32.38 | 51.56,30.48 53.52,30.48 IC5.109 55.63,32.58 C17.1 | 46.1,36.2 46.1,36.49 IC5.128 47.76,38.1 C15.1 | IC5.103 50.93,28.52 50.93,28.57 | 47.75,25.4 47.75,25.34 IC5.94 49.67,23.61 50.17,23.11 50.96,23.11 52.41,21.66 53.33,21.66 C18.1 | 43.56,21.21 43.56,21.04 IC5.82 47.93,16.67 C23.1 | IC5.67 39.06,19.56 39.12,19.56 | IC5.72 39.59,16.55 39.59,14.45 C22.1 | 33.4,25.27 33.4,25.21 IC5.51 30.04,21.84 v29.72,21.84 | IC5.49 32.69,25.91 32.77,25.91 | 38.61,39.37 38.21,39.12 IC5.9 33.36,43.97 C21.1 | 58.93,30.23 58.93,28.49 58.14,27.71 58.14,27.18 | 58.93,30.23 C13.+ | 58.14,17.53 58.14,27.18 | C1.1 59.12,30.04 58.93,30.23 | C2.1 58.14,17.53 | IC5.108 54.43,29.9 54.36,29.97 | 33.53,34.29 33.39,34.04 IC5.23 30.48,36.95 v30.48,37.08 29.97,37.59 Q1.4 | Q1.1 Q1.4 | v9.91,45.47 11.34,45.47 | C30.1 25.47,38.17 Q1.4 | IC2.2 58.13,27.17 58.14,27.18 | IC1.2 57.9,14.97 58.14,15.22 58.14,17.53 | IC5.31 30.48,31.29 30.48,31.24 | v12.19,29.21 11.68,28.7 11.68,27.18 | C15.1 49.19,40.4 | R10.1 54,43.34 49.54,43.34 | 49.54,43.34 R12.1 | C15.1 49.54,40.56 49.54,43.34 | 40.64,17.6
  Top 0.254: 39.59,16.55 40.64,17.6 | 40.64,17.6 40.64,18.8 | IC5.73 40.64,17.6 | v37.59,9.4 38.1,9.91 38.1,14.99 39.12,16 IC5.72 | IC4.8 27.94,14.99 28.7,14.22 v27.43,12.95 24.38,9.91 | v35.56,7.37 35.56,6.76 IC4.24 38.51,3.81 | 38.51,3.81 C9.+ | 24.38,9.91 24.13,9.91 | 24.38,9.91 24.56,9.91 C10.1 | C11.1 37.53,2.83 38.51,3.81 | 17.02,27.05 17.08,27.11 | v8.89,21.84 C4.+
  Top 0.406: SV1.2 SV1.4 11.34,35.4 11.34,45.47 11.34,48.93 13.72,51.31 23.57,51.31 24.68,50.19 26.37,50.19 27.49,51.31 SV4.4 | SV1.2 11.68,27.18 C6.+ C4.+ | 17.08,27.11 SV1.2 | IC5.1 40.64,42.35 40.64,41.66 | 40.64,41.66 40.64,41.4 38.61,39.37 33.53,34.29 30.48,31.24 29.97,30.73 29.97,29.46 | 29.97,29.46 29.97,28.7 32.77,25.91 33.4,25.27 39.12,19.56 39.88,18.8 40.64,18.8 41.15,18.8 43.56,21.21 47.75,25.4 50.93,28.57 51.56,29.21 51.56,29.97 | 51.56,29.97 51.56,30.48 51.56,30.73 50.55,31.75 49.91,32.38 46.1,36.2 42.16,40.13 40.64,41.66 | SV1.2 18.44,28.6 20.02,28.6 20.89,29.46 21.59,29.46 | 21.59,29.46 27.69,29.46 28.19,29.46 29.97,29.46 | C13.+ 58.67,30.01 58.67,29.97 54.36,29.97 51.56,29.97 | v21.59,30.73 21.59,29.46
  Bottom 0.152: R7.2 28.26,47.18 29.44,48.36 29.44,50.32 | R8.2 36.9,50.73 36.48,50.32 29.44,50.32 | 29.44,50.32 SV4.4 26.48,52.51 C31.2 | C19.1 29.72,21.34 v29.72,21.84 | v30.48,37.08 C20.1 | IC3.8 9.53,44.26 C8.2 9.65,45.21 v9.91,45.47 | SJ3.1 SJ2.1 SJ1.1 9.91,30.73 12.13,30.73 R6.1 v12.19,29.21 | C29.1 25.65,28.7 v26.16,28.7
  Bottom 0.254: v35.56,7.37 v37.59,9.4 | C7.1 SV1.2 | v8.89,21.84 8.64,21.59 8.64,18.86 C33.1 SV5.4 SV5.2 | v27.43,12.95 25.65,14.73 18.54,14.73 18.54,23.37 18.95,23.77 C12.+
  Bottom 0.406: R1.1 22.1,31.24 v21.59,30.73 21.59,24.54 C12.+
BUFFER0_OE
  Top 0.152: IC1.10 57.01,10.04 56.69,10.04 IC5.85
BUFFER1_OE
  Top 0.152: IC2.10 52.53,21.97 IC5.96
CLKIN_24
  Top 0.152: 29.33,33.92 IC5.29 26.76,36.42 Q1.3
CONF_DONE
  Top 0.152: 56.39,44.45 59.18,44.45 LED6.A | IC5.138 45.1,42.56 45.98,42.56 47.87,44.45 49.09,44.45 49.24,44.6 49.43,44.6 49.58,44.45 56.39,44.45 | R10.2 56.39,44.45
CONFIG_SEL
  Top 0.152: IC5.126 49.72,38.7 R11.2
GND  (via drill 0.35)
  other vias: 38.35,32.26 41.4,34.8 44.96,30.23 40.64,25.65 33.27,24.13 29.46,27.94 30.23,32.51 39.88,41.91 43.18,40.39 45.97,37.59 46.99,36.58 50.04,33.53 51.56,32 52.07,28.45 51.05,27.43 49.02,25.4 47.75,24.13 44.7,21.08 43.69,20.07 41.4,17.78 37.85,19.56 38.86,18.54 31.5,25.91 35.31,37.59 59.18,32.77 57.4,28.7 62.48,19.05 36.07,16.26 31.5,18.29 40.64,16.76 36.83,10.16 39.12,10.16 38.1,5.59 36.07,3.3 38.1,40.39 40.83,39.88 50.8,29.97 40.39,19.81 30.73,28.96 42.16,41.4 28.96,30.23 26.67,34.54 37.08,44.2 40.64,44.2 3.94,37.08 13.97,50.55 13.97,52.07 53.34,20.57 56.13,18.29 57.4,21.34 26.85,16.26 32.77,43.18 48.26,48.01 49.02,45.47 52.07,42.42 41.91,48.01 4.57,32.51 2.54,27.18 2.54,21.84 2.54,23.62 2.54,20.07 2.54,25.4 2.54,28.96 4.57,31.75 4.57,33.27 22.1,20.83 27.69,10.16 27.18,7.62 37.34,14.73 42.16,14.99 50.55,14.22 45.97,24.64 35.05,24.64 35.99,35.56 45.47,35.81 22.35,28.7 28.7,36.32 22.35,39.12 27.18,38.35 22.61,25.15 32,34.29 33.02,35.31 37.08,39.37 44.7,38.86 48.51,35.05 52.32,31.24 50.04,26.42 46.23,22.61 42.67,18.8 35.56,21.84 38.1,27.69 42.93,32.26 42.93,27.69 39.37,36.83 40.39,35.81 65.53,48.51 65.53,46.48 65.53,50.55 65.53,52.58 55.63,39.37 63.25,8.38 36.83,12.45 29.97,14.99 30.73,11.43 31.5,6.6 21.59,12.95 46.74,49.53 46.74,51.56 43.18,51.56 41.66,49.53 34.8,43.43 9.65,40.64 51.31,3.81 51.31,5.59 51.31,2.03 19.81,12.95 23.37,12.95 36.32,46.99 59.18,39.12 33.78,1.52 13.97,48.77 10.41,48.77 12.7,40.64 14.99,40.64 50.55,43.9 54.86,43.69 60.2,12.7 60.2,24.89 63.5,5.84 23.11,15.75
  pour Top: 0,0 0,54.23 73.91,54.23 73.91,0
  pour Bottom: 0,0 0,54.23 73.91,54.23 73.91,0
I2C_SCL
  Bottom 0.152: IC3.6 5.21,44.71 10.51,50.02 14.19,50.02 14.21,50.04 SV1.20 17.02,48.9 18.01,47.91 18.01,47.09 17.43,46.51 17.04,46.51 13.97,43.43 SV5.10
I2C_SDA
  Bottom 0.152: IC3.5 4.68,43.52 4.68,43.06 4.81,42.93 6.87,42.93 7.01,43.06 7.01,46.08 8.43,47.5 SV1.18 17.02,46.91 13.66,43.56 13.66,16.71 SV5.8
JTAG_TCK  (via drill 0.35)
  Top 0.152: v30.73,40.39 33.27,37.85 IC5.18 | v30.73,43.18 30.25,43.66 28.48,43.66 25.91,46.24 SV4.1
  Bottom 0.152: v30.73,40.39 v30.73,43.18 | R9.2 26.1,48.58 SV4.1
JTAG_TDI  (via drill 0.35)
  Top 0.152: IC5.19 32.77,37.34 31.24,38.86 31.24,39.12 29.97,40.39 v29.72,40.39 | v32.51,45.72 35.56,48.77 SV4.9
  Bottom 0.152: v29.72,40.39 29.72,42.93 v32.51,45.72 | R8.1 36.13,48.83 SV4.9
JTAG_TDO  (via drill 0.35)
  Top 0.152: IC5.20 32.51,37.08 29.97,39.62 29.72,39.62 v28.96,40.39 | SV4.3 28.7,48.51 v28.7,44.2
  Bottom 0.152: v28.96,40.39 28.7,40.64 v28.7,44.2
JTAG_TMS  (via drill 0.35)
  Top 0.152: IC5.16 33.78,38.61 33.27,39.12 33.02,39.12 32,40.13 32,40.39 v31.75,40.39 | v31.75,43.18 31.75,46.99 30.99,47.75 SV4.5
  Bottom 0.152: v31.75,43.18 v31.75,40.39 | R7.1 30.16,48.7 SV4.5
N$1
  Top 0.152: R4.2 LED3.A
N$2
  Top 0.152: R5.2 LED4.A
N$3  (via drill 0.35)
  Top 0.152: v10.92,32.51 LED5.A
  Bottom 0.152: R6.2 11.11,32.7 v10.92,32.51
N$5
  Bottom 0.152: SJ1.2 5.21,33.91 IC3.3
N$6
  Bottom 0.152: SJ2.2 6.48,34.92 IC3.2
N$7
  Bottom 0.152: SJ3.2 7.75,36.45 IC3.1
N$13
  Top 0.152: LED1.A 60.2,46.48 58.74,46.48 R2.2
N$14
  Top 0.152: R3.2 LED2.A
OUTPUT0
  Top 0.152: IC1.20 65.92,15.62 66.52,16.23 66.52,16.29 66.83,16.59 66.83,18.7 67.82,19.69 SV2.10
OUTPUT1
  Top 0.152: IC1.18 65.96,14.32 66.83,15.19 66.83,16.16 67.82,17.15 SV2.8
OUTPUT2
  Top 0.152: SV2.6 65.75,13.68 IC1.17
OUTPUT3
  Top 0.152: IC1.16 67.64,13.03 SV2.4
OUTPUT4
  Top 0.152: IC1.15 67.25,12.38 67.41,12.22 68.23,12.22 68.83,12.82 68.83,19.81 69.85,20.83 SV2.9
OUTPUT5
  Top 0.152: SV2.7 69.68,18.29 69.14,17.75 69.14,12.7 68.17,11.72 IC1.14
OUTPUT6
  Top 0.152: SV2.3 68.81,11.66 68.81,10.26 68.23,9.68 67.41,9.68 66.01,11.07 IC1.13
OUTPUT7
  Top 0.152: SV2.5 70.36,14.61 71.35,13.62 71.35,12.8 70.77,12.22 69.8,12.22 69.11,11.53 69.11,10.13 68.36,9.37 67.28,9.37 66.23,10.43 IC1.12
OUTPUT8
  Top 0.152: SV3.10 67.31,41.91 66.55,41.15 66.55,37.56 64.65,35.65 64.65,28.58 63.88,27.82 IC2.20
OUTPUT9
  Top 0.152: SV3.8 66.85,38.41 66.85,37.43 64.95,35.53 64.95,27.61 63.85,26.52 IC2.18
OUTPUT10
  Top 0.152: SV3.6 66.68,36.83 65.25,35.4 65.25,27.49 63.64,25.87 IC2.17
OUTPUT11  (via drill 0.35)
  Top 0.152: 63.5,25.15 63.25,25.15 63.14,25.2 IC2.16 63.83,25.22 64.01,25.4 64.14,25.53 65.63,27.03 65.63,33.55 65.79,33.7 v65.79,34.04 65.79,33.78
  Bottom 0.152: v65.79,34.04 66.55,34.04 66.8,34.29 SV3.4
OUTPUT12
  Top 0.152: SV3.9 68.81,40.36 68.81,36.42 68.23,35.84 67.71,35.84 66.32,34.45 66.32,33.8 65.94,33.42 65.94,26.9 63.61,24.57 IC2.15
OUTPUT13
  Top 0.152: SV3.7 69.88,39.37 69.11,38.61 69.11,34.18 68.23,33.3 66.47,33.3 66.47,33.08 66.24,32.85 66.24,26.36 63.8,23.92 IC2.14
OUTPUT14
  Top 0.152: SV3.3 69.65,34.29 68.36,32.99 66.81,32.99 66.55,32.73 66.55,26.24 63.58,23.27 IC2.13
OUTPUT15
  Top 0.152: SV3.5 70.36,35.69 71.35,34.7 71.35,33.88 70.77,33.3 69.09,33.3 68.81,33.02 68.81,31.34 66.85,29.38 66.85,26.11 64.01,23.27 64.01,22.86 63.77,22.62 IC2.12
PWM_OUT0
  Top 0.152: IC5.86 52.64,14.79 52.78,14.65 52.78,14.48 56.84,10.43 IC1.9
PWM_OUT1
  Top 0.152: IC5.87 53.09,15.05 53.09,14.61 56.62,11.07 IC1.8
PWM_OUT2
  Top 0.152: IC5.88 53.39,15.45 53.39,14.73 56.4,11.72 IC1.7
PWM_OUT3
  Top 0.152: IC5.89 47.81,21.84 53.7,15.96 53.7,14.86 56.18,12.38 IC1.6
PWM_OUT4
  Top 0.152: IC5.90 54,16.26 54,14.99 55.96,13.03 IC1.5
PWM_OUT5
  Top 0.152: IC5.91 48.42,22.54 54.3,16.65 54.3,15.11 55.74,13.68 IC1.4
PWM_OUT6
  Top 0.152: IC5.92 54.61,17.06 54.61,15.24 55.52,14.32 IC1.3
PWM_OUT7
  Top 0.152: IC5.93 56.76,15.62 IC1.1
PWM_OUT8
  Top 0.152: IC2.9 52.59,22.62 IC5.97
PWM_OUT9
  Top 0.152: IC2.8 52.65,23.27 IC5.98
PWM_OUT10
  Top 0.152: IC2.7 52.7,23.92 IC5.99
PWM_OUT11
  Top 0.152: IC2.6 52.76,24.57 IC5.100
PWM_OUT12
  Top 0.152: IC2.5 52.82,25.22 IC5.101
PWM_OUT13
  Top 0.152: IC2.4 52.88,25.87 IC5.102
PWM_OUT14
  Top 0.152: IC5.105 54.35,26.52 IC2.3
PWM_OUT15
  Top 0.152: IC2.1 55.07,27.82 54.6,27.35 54.22,27.35 IC5.106
SPI_MISO
  Top 0.152: SV1.12 18.01,40.87 21.52,40.87 22.52,41.87 33.14,41.87 IC5.12 35.31,39.88
SPI_MOSI
  Top 0.152: SV1.10 17.02,38.1 17.8,38.89 19.97,38.89 22.65,41.57 32.93,41.57 34.42,40.08 IC5.13
SPI_SCK
  Top 0.152: SV1.8 17.02,35.51 18.57,37.05 18.57,37.75 19.15,38.33 19.84,38.33 22.74,41.23 32.26,41.23 | 32.26,41.23 | IC5.14 32.57,41.23 32.26,41.23
SRAM_A0
  Top 0.152: IC5.56 30.27,18.54 IC4.1
SRAM_A1
  Top 0.152: IC4.2 29.91,17.52 29.37,18.07 29.37,18.35 IC5.55
SRAM_A2
  Top 0.152: IC4.3 29.31,17.43 28.76,17.97 28.76,18.45 IC5.54
SRAM_A3
  Top 0.152: IC4.4 28.95,17.07 28.41,17.62 28.41,19.51 IC5.52
SRAM_A4
  Top 0.152: IC4.13 25.77,13.89 25.23,14.44 25.23,22.69 IC5.43
SRAM_A5
  Top 0.152: IC4.14 25.42,13.54 24.87,14.08 24.87,23.75 IC5.41
SRAM_A6
  Top 0.152: IC4.15 25.07,13.18 24.52,13.73 24.52,24.81 IC5.39
SRAM_A7
  Top 0.152: IC4.16 24.71,12.83 24.16,13.38 24.16,25.16 IC5.38
SRAM_A8
  Top 0.152: IC4.17 32.51,4.86 32.51,20.07 33.92,21.48 IC5.57
SRAM_A9
  Top 0.152: IC5.58 32.82,19.67 32.82,5.26 IC4.18
SRAM_A10
  Top 0.152: IC4.19 33.12,5.66 33.12,19.55 33.85,20.28 33.94,20.28 34.44,20.78 IC5.59
SRAM_A11
  Top 0.152: IC4.20 33.43,6.06 33.43,18.87 IC5.60
SRAM_A12
  Top 0.152: IC4.21 33.73,6.47 33.73,18.47 IC5.61
SRAM_A13
  Top 0.152: IC4.29 35.56,10.29 35.56,13.93 IC5.70
SRAM_A14
  Top 0.152: IC5.76 43.94,16.42 43.94,10.67 40.39,7.11 39.45,7.11 IC4.30
SRAM_A15
  Top 0.152: IC4.31 39.85,7.42 40.26,7.42 43.64,10.79 43.64,16.02 IC5.75
SRAM_A16
  Top 0.152: IC4.32 40.1,7.87 40.29,7.87 43.33,10.92 43.33,15.61 IC5.74
SRAM_D0
  Top 0.152: IC4.6 28.25,16.36 27.7,16.91 27.7,21.63 IC5.48
SRAM_D1
  Top 0.152: IC4.7 27.89,16.01 27.35,16.56 27.35,21.98 IC5.47
SRAM_D2
  Top 0.152: IC4.10 26.83,14.95 26.29,15.5 26.29,21.63 IC5.46
SRAM_D3
  Top 0.152: IC4.11 26.48,14.6 25.93,15.14 25.93,21.98 IC5.45
SRAM_D4
  Top 0.152: IC4.22 34.04,6.87 34.04,18.07 IC5.62
SRAM_D5
  Top 0.152: IC4.23 34.34,7.27 34.34,16.95 IC5.64
SRAM_D6
  Top 0.152: IC4.26 34.65,9.09 34.65,16.55 IC5.65
SRAM_D7
  Top 0.152: IC4.27 34.95,9.49 34.95,16.15 IC5.66
STATUS0
  Top 0.152: IC5.141 46.9,46.48 47.13,46.48 47.24,46.59 47.43,46.59 47.54,46.48 R2.1
STATUS1
  Top 0.152: IC5.6 36.07,43.38 36.07,44.45 40.39,48.77 52.39,48.77 R3.1
STATUS2
  Top 0.152: IC5.7 37.1,41.83 35.76,43.17 35.76,44.58 41.73,50.55 R4.1
STATUS3
  Top 0.152: IC5.8 36.75,41.48 35.46,42.77 35.46,44.7 43.33,52.58 R5.1
V+0  (via drill 0.35)
  Top 0.152: v61.98,14.99 62.24,14.97 IC1.19
  Bottom 0.152: C5.1 65.95,8.8 SV2.2 65.79,10.67 61.98,14.48 v61.98,14.99
V+1  (via drill 0.35)
  Top 0.152: v61.98,27.18 61.99,27.17 IC2.19
  Bottom 0.152: SV3.2 67.88,31.68 C3.1 67.88,27.75 67.31,27.18 v61.98,27.18
VCCA  (via drill 0.35)
  Top 0.152: v39.12,40.89 39.12,41.04 IC5.5 37.31,42.85 37.31,43.23 38.19,44.11 | IC5.143 41.4,42.4 v41.4,41.91 | IC5.107 53.07,29.21 v52.83,29.21 | IC5.71 39.62,17.29 v39.62,17.78 | IC5.34 IC5.35 | 38.19,44.11 39.55,45.47 | C27.1 39.55,45.47 | 39.55,45.47 39.62,45.47 | IC5.2 38.19,44.09 38.19,44.11
  Top 0.406: v29.21,31.24 28.41,31.24 IC5.34
  Bottom 0.152: v39.12,40.89 40.26,39.75 40.26,38.99 | v41.4,41.91 41.4,40.12 41.42,40.1 41.42,39.14 41.27,38.99 | 49.66,29.34 49.78,29.21 v52.83,29.21 C28.1 | 40.01,20.7 40.01,20.45 39.62,20.07 v39.62,17.78 39.62,15.94 C24.1
  Bottom 0.406: 39.37,21.34 40.01,20.7 40.13,20.57 40.89,20.57 49.66,29.34 50.04,29.72 50.04,30.23 49.28,30.99 | 39.37,21.34 32.51,28.19 | 32.51,28.19 30.99,29.72 | 49.28,30.99 41.27,38.99 40.26,38.99 31.75,30.23 31.24,29.72 30.99,29.72 | C25.+ 32.77,28.19 32.51,28.19 | C26.1 24.98,33.5 R1.2 v29.21,31.24 30.73,29.72 30.99,29.72 | C32.1 49.28,30.99 | 49.28,30.99 | C34.1 39.37,21.34 | 39.37,21.34

### Text on the board
tNames: FPGA JTAG | 3V3 Good | ↯ Electric Blunt Here | Front Panel | SV2: Channels 1-8 / SV3: Channels 9-16 | Lichtenstein MAX-10 Driver / Rev 01 / (c) Tristan Seifert 2018